# Altium project NRV-AOU34.PrjPCB
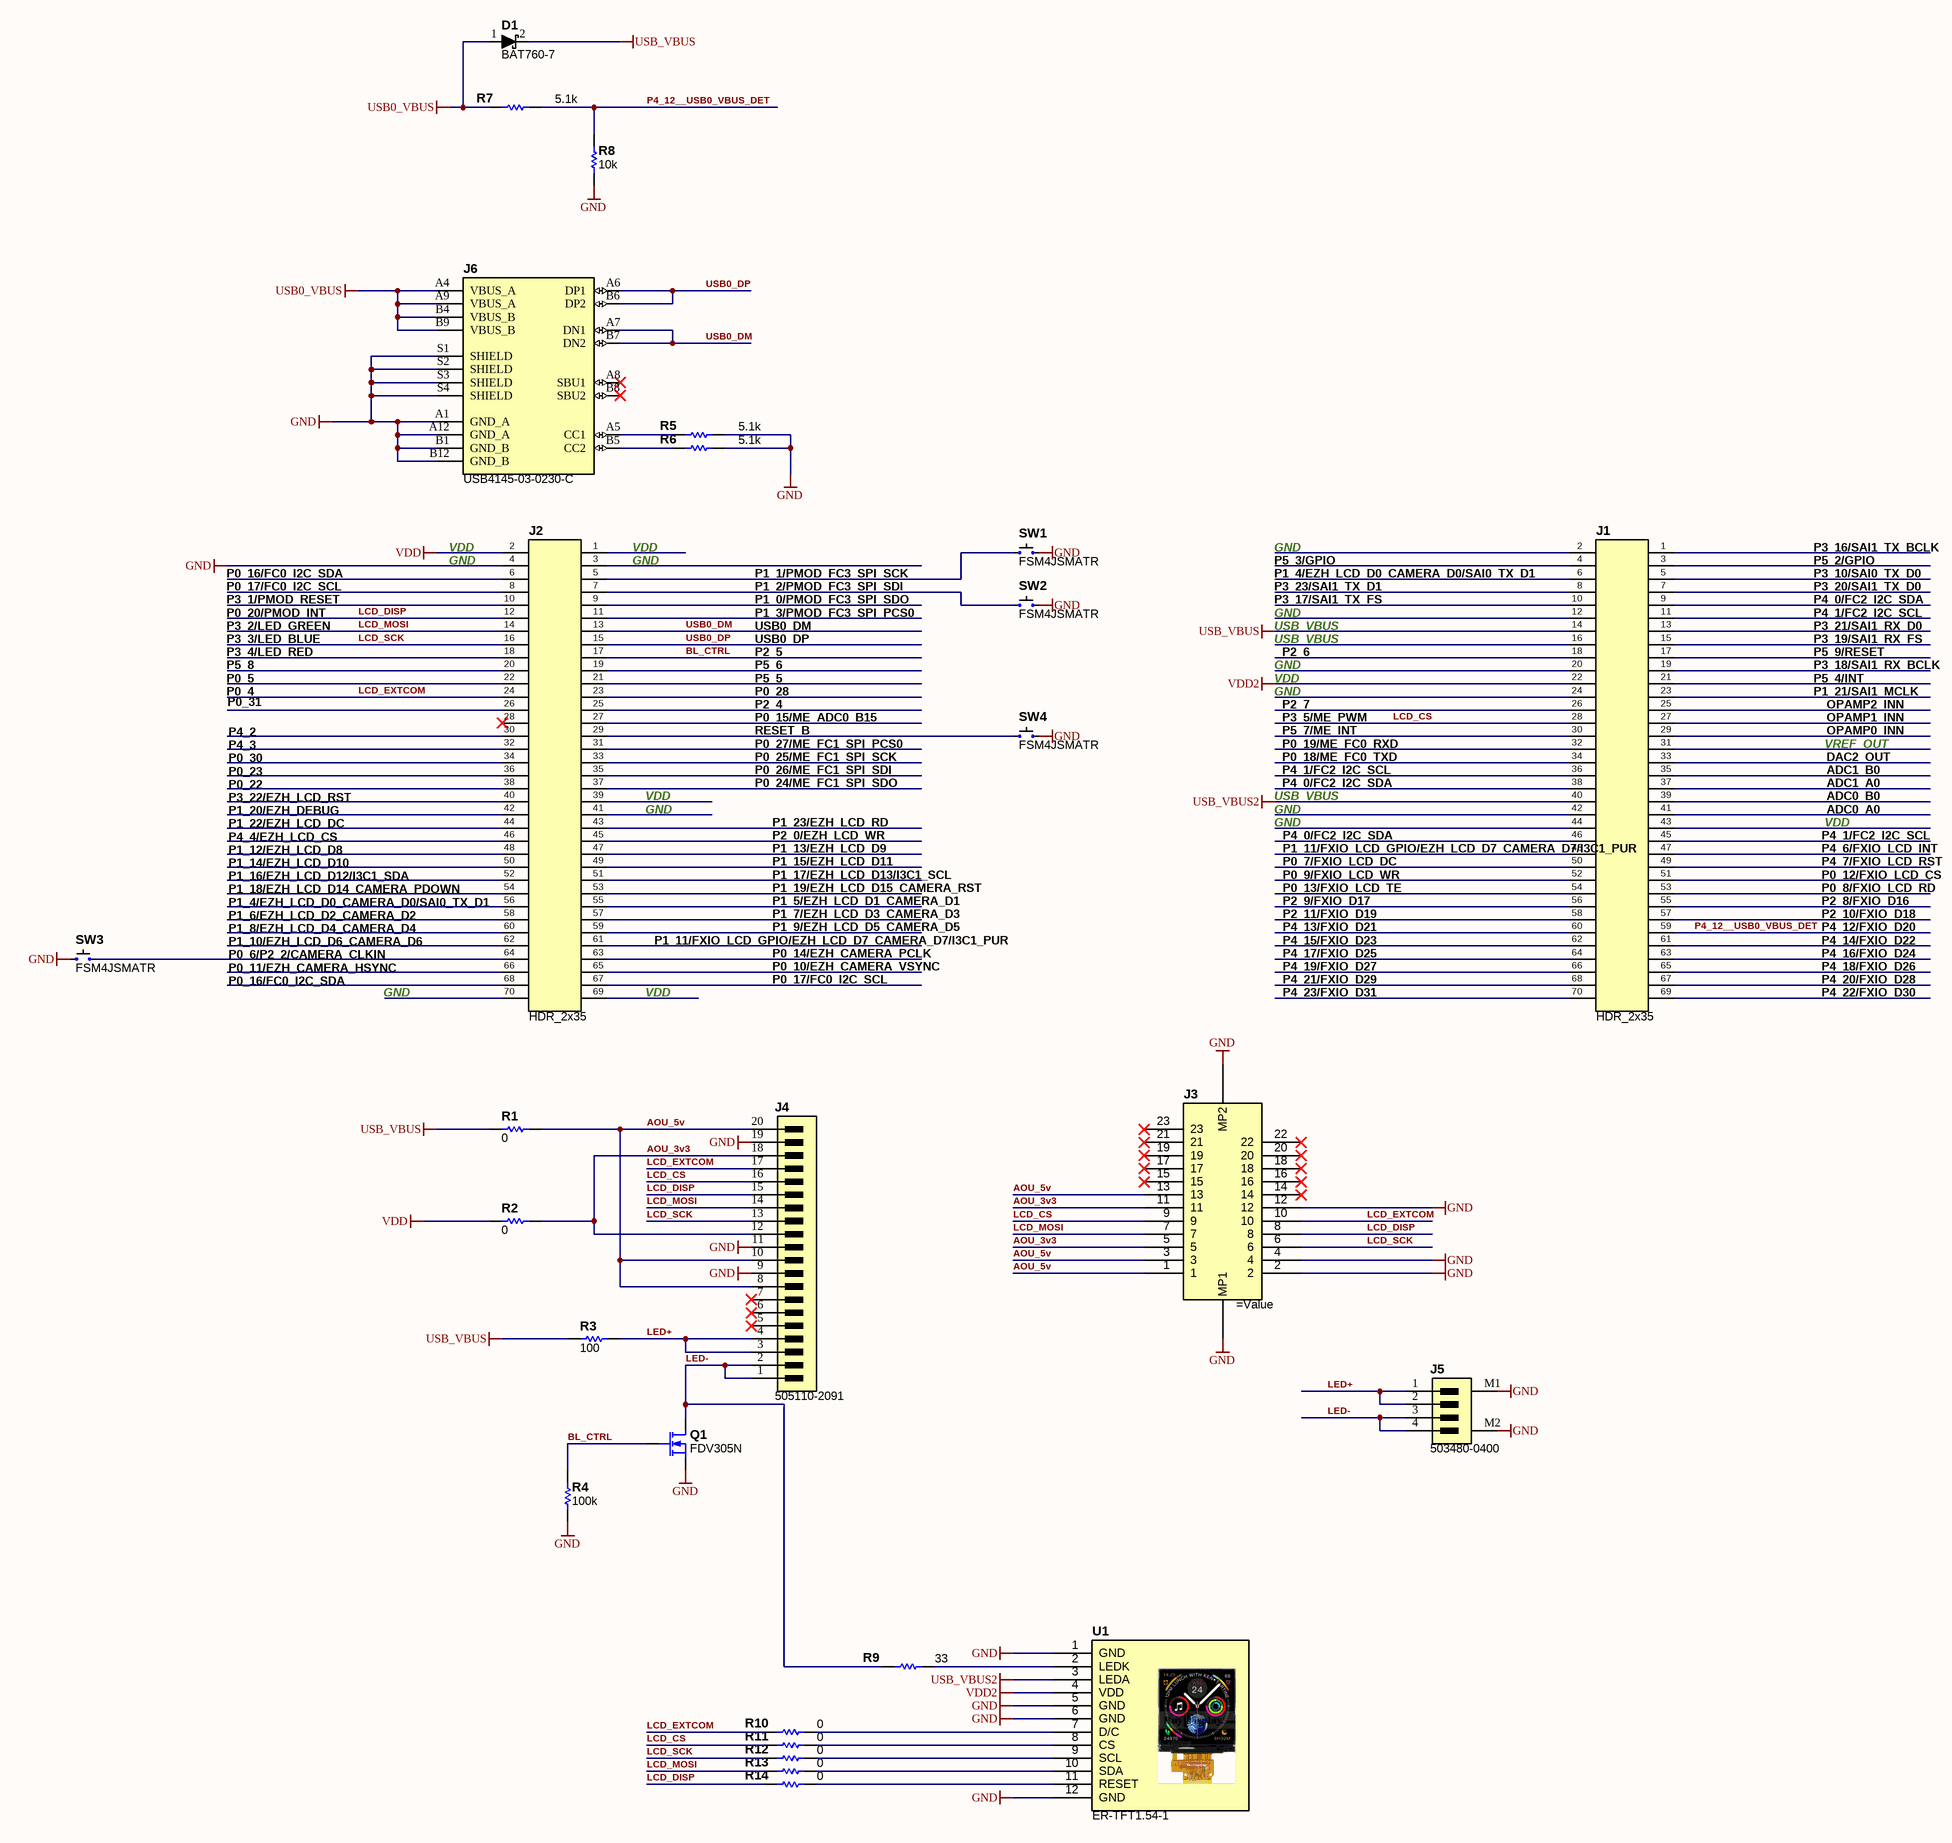
[diagram p0: NRV-AOU34.SchDoc]
SCH_DATE: 2023-04-23; PROJECT_TITLE_LINE_1: NRV_AOU34; PROJECT_STATUS: PROTOTYPE; PROJECT_SHORT_TITLE: NRV_AOU34; PROJECT_ENGINEER: E. Hughes; PCB_VERSION: A; PCB_TITLE: NRV-MEM-LCD; PCB_SOLDER_MASK_COLOR_BOTTOM: BLACK; PCB_SILKSCREEN_COLOR_TOP: BLACK; PCB_SILKSCREEN_COLOR_BOTTOM: none; PCB_PRINTOUT_SCALE: 1:1; PCB_PART_NUMBER: NRV_AOU34; PCB_MIN_TRACE_WIDTH: 6; PCB_MIN_TRACE_SPACE: 6; PCB_MIN_DRILL: 10; PCB_MATERIAL: FR4; PCB_LAYERS: 6; PCB_FINISH_PLATING: GOLD ENIG; PCB_FINISHED_THICKNESS: .0625; PCB_COPPER_WEIGHT_OUTER: 1oz; PCB_COPPER_WEIGHT_INNER: 1oz; CCA_TITLE: Azumo 3.4" Dev; CCA_PART_NUMBER: NRV_AOU34; BOM_NOTES_LINE_4: -; BOM_NOTES_LINE_3: -; BOM_NOTES_LINE_2: -; BOM_NOTES_LINE_1: -
1 sheet, 27 parts. Net scope: hierarchical (ports join the sheet entries above them; power ports are global).
Board file: NRV-AOU34.PCBDOC

## Sheet NRV-AOU34.SchDoc
size D

### Parts
D1  BAT760-7  [D_SOD-323_P]
J1  HDR_2x35  [HEADER 2x35 .100"]
J2  HDR_2x35  [HEADER 2x35 .100"]
J3  (no value)  [FH26W-23S-0.3SHW(60)]
J4  505110-2091  [CON_5051102091_MOL]
J5  503480-0400  [5034800400]
J6  USB4145-03-0230-C  [GCT_USB4145-03-0230-C_REVA2]
Q1  FDV305N  [SOT-23]
R1  0  [R0603_0.55MM_MD]
R2  0  [R0603_0.55MM_MD]
R3  100  [R0805_0.65MM_MD]
R4  100k  [R0805_0.65MM_MD]
R5  5.1k  [R0603_0.55MM_MD]
R6  5.1k  [R0603_0.55MM_MD]
R7  5.1k  [R0603_0.55MM_MD]
R8  10k  [R0603_0.55MM_MD]
R9  33  [R0603_0.55MM_MD]
R10  0  [R0603_0.55MM_MD]
R11  0  [R0603_0.55MM_MD]
R12  0  [R0603_0.55MM_MD]
R13  0  [R0603_0.55MM_MD]
R14  0  [R0603_0.55MM_MD]
SW1  FSM4JSMATR  [FSM4JSMA]
SW2  FSM4JSMATR  [FSM4JSMA]
SW3  FSM4JSMATR  [FSM4JSMA]
SW4  FSM4JSMATR  [FSM4JSMA]
U1  ER-TFT1.54-1  [ER-TFT1.54-1]

### Nets
GND: J2.4 J3.2 J3.4 J3.12 J3.MP1 J3.MP2 J4.9(B4) J4.11(B2) J4.19(G1) J5.M1 J5.M2 J6.A1(GND_A) J6.A12(GND_A) J6.B1(GND_B) J6.B12(GND_B) J6.S1(SHIELD) J6.S2(SHIELD) J6.S3(SHIELD) J6.S4(SHIELD) Q1.2 R4.2 R5.2 R6.2 R8.1 SW1.A SW2.A SW3.A SW4.A U1.1(GND) U1.5(GND) U1.6(GND) U1.12(GND)
USB0_VBUS: D1.1(A) J6.A4(VBUS_A) J6.A9(VBUS_A) J6.B4(VBUS_B) J6.B9(VBUS_B) R7.1
USB_VBUS: D1.2(K) J1.14 R1.1 R3.2
USB_VBUS2: J1.40 U1.3(LEDA)
VDD: J2.2 R2.1
VDD2: J1.22 U1.4(VDD)
AOU_3v3: J3.5 J3.11 J4.12(B1) J4.18(G2) R2.2
AOU_5v: J3.1 J3.3 J3.13 J4.8(B5) J4.10(B3) J4.20(G0) R1.2
BL_CTRL: J2.17 Q1.1(G) R4.1
LCD_CS: J1.28 J3.9 J4.16(G4) R11.1
LCD_DISP: J2.12 J3.8 J4.15(G5) R14.1
LCD_EXTCOM: J2.24 J3.10 J4.17(G3) R10.1
LCD_MOSI: J2.14 J3.7 J4.14(VSS) R13.1
LCD_SCK: J2.16 J3.6 J4.13(B0) R12.1
LED+: J4.3(VCC) J4.4(VCC) J5.1(VSS) J5.2(VSS) R3.1
LED-: J4.1(VSS) J4.2(VSS) J5.3(VCC) J5.4(VCC) Q1.3(D) R9.1
P4_12__USB0_VBUS_DET: J1.59 R7.2 R8.2
USB0_DM: J2.13 J6.A7(DN1) J6.B7(DN2)
USB0_DP: J2.15 J6.A6(DP1) J6.B6(DP2)
NetJ2_5: J2.5 SW1.B
NetJ2_7: J2.7 SW2.B
NetJ2_29: J2.29 SW4.B
NetJ2_64: J2.64 SW3.B
NetJ6_A5: J6.A5(CC1) R5.1
NetJ6_B5: J6.B5(CC2) R6.1
NetR9_2: R9.2 U1.2(LEDK)
NetR10_2: R10.2 U1.7(D/C)
NetR11_2: R11.2 U1.8(CS)
NetR12_2: R12.2 U1.9(SCL)
NetR13_2: R13.2 U1.10(SDA)
NetR14_2: R14.2 U1.11(RESET)

Not connected (* = marked no-connect by the designer): J1 1 2 3 4 5 6 7 8 9 10 11 12 13 15 16 17 18 19 20 21 23 24 25 26 27 29 30 31 32 33 34 35 36 37 38 39 41 42 43 44 45 46 47 48 49 50 51 52 53 54 55 56 57 58 60 61 62 63 64 65 66 67 68 69 70; J2 1 3 6 8 9 10 11 18 19 20 21 22 23 25 26 27 28* 30 31 32 33 34 35 36 37 38 39 40 41 42 43 44 45 46 47 48 49 50 51 52 53 54 55 56 57 58 59 60 61 62 63 65 66 67 68 69 70; J3 14* 15* 16* 17* 18* 19* 20* 21* 22* 23*; J4 5(PWCTRL)* 6(LEDCTRL)* 7(RESET#)*; J6 A8(SBU1)* B8(SBU2)*

### Notes on the sheet
- VDD
- GND
- (near J2) VDD
- (near J2) GND
- P5_3/GPIO
- P3_16/SAI1_TX_BCLK
- P5_2/GPIO
- P0_16/FC0_I2C_SDA
- P0_17/FC0_I2C_SCL
- P3_1/PMOD_RESET
- P0_20/PMOD_INT
- P3_2/LED_GREEN
- P1_1/PMOD_FC3_SPI_SCK
- P1_2/PMOD_FC3_SPI_SDI
- P1_0/PMOD_FC3_SPI_SDO
- P1_3/PMOD_FC3_SPI_PCS0
- USB0_DM
- P1_4/EZH_LCD_D0_CAMERA_D0/SAI0_TX_D1
- P3_23/SAI1_TX_D1
- P3_17/SAI1_TX_FS
- USB_VBUS
- P3_10/SAI0_TX_D0
- P3_20/SAI1_TX_D0
- P4_0/FC2_I2C_SDA
- P4_1/FC2_I2C_SCL
- P3_21/SAI1_RX_D0
- P3_3/LED_BLUE
- P3_4/LED_RED
- P5_8
- P0_5
- P0_4
- USB0_DP
- P2_5
- P5_6
- P5_5
- P0_28
- P2_6
- P3_19/SAI1_RX_FS
- P5_9/RESET
- P3_18/SAI1_RX_BCLK
- P5_4/INT
- P1_21/SAI1_MCLK
- P0_31
- P4_2
- P4_3
- P0_30
- P2_4
- P0_15/ME_ADC0_B15
- RESET_B
- P0_27/ME_FC1_SPI_PCS0
- P0_25/ME_FC1_SPI_SCK
- P2_7
- P3_5/ME_PWM
- P5_7/ME_INT
- P0_19/ME_FC0_RXD
- P0_18/ME_FC0_TXD
- VREF_OUT
- OPAMP2_INN
- OPAMP1_INN
- OPAMP0_INN
- DAC2_OUT
- P0_23
- P0_22
- P3_22/EZH_LCD_RST
- P1_20/EZH_DEBUG
- P1_22/EZH_LCD_DC
- P0_26/ME_FC1_SPI_SDI
- P0_24/ME_FC1_SPI_SDO
- P1_23/EZH_LCD_RD
- ADC1_B0
- ADC1_A0
- ADC0_B0
- ADC0_A0
- P4_4/EZH_LCD_CS
- P1_12/EZH_LCD_D8
- P1_14/EZH_LCD_D10
- P1_16/EZH_LCD_D12/I3C1_SDA
- P1_18/EZH_LCD_D14_CAMERA_PDOWN
- P2_0/EZH_LCD_WR
- P1_13/EZH_LCD_D9
- P1_15/EZH_LCD_D11
- P1_17/EZH_LCD_D13/I3C1_SCL
- P1_19/EZH_LCD_D15_CAMERA_RST
- (near J1) P1_11/FXIO_LCD_GPIO/EZH_LCD_D7_CAMERA_D7/I3C1_PUR
- P0_7/FXIO_LCD_DC
- P0_9/FXIO_LCD_WR
- P0_13/FXIO_LCD_TE
- P4_6/FXIO_LCD_INT
- P4_7/FXIO_LCD_RST
- P0_12/FXIO_LCD_CS
- P0_8/FXIO_LCD_RD
- P1_6/EZH_LCD_D2_CAMERA_D2
- P1_8/EZH_LCD_D4_CAMERA_D4
- P1_10/EZH_LCD_D6_CAMERA_D6
- P0_6/P2_2/CAMERA_CLKIN
- P1_11/FXIO_LCD_GPIO/EZH_LCD_D7_CAMERA_D7/I3C1_PUR
- P1_5/EZH_LCD_D1_CAMERA_D1
- P1_7/EZH_LCD_D3_CAMERA_D3
- P1_9/EZH_LCD_D5_CAMERA_D5
- P0_14/EZH_CAMERA_PCLK
- P2_9/FXIO_D17
- P2_11/FXIO_D19
- P4_13/FXIO_D21
- P4_15/FXIO_D23
- P4_17/FXIO_D25
- P2_8/FXIO_D16
- P2_10/FXIO_D18
- P4_12/FXIO_D20
- P4_14/FXIO_D22
- P4_16/FXIO_D24
- P0_11/EZH_CAMERA_HSYNC
- P0_10/EZH_CAMERA_VSYNC
- P4_19/FXIO_D27
- P4_21/FXIO_D29
- P4_23/FXIO_D31
- P4_18/FXIO_D26
- P4_20/FXIO_D28
- P4_22/FXIO_D30
- PCB REV
- CCA REV
- Sheet
- of

### Library data of the parts
D1 = BAT760-7: DIODE SCHOTTKY 30V 1A SOD323; Manufacturer: Diodes Inc; CategorySort: 400; Voltage - Forward (Vf) (Max) @ If: 550mV @ 1A; Speed: Fast Recovery =< 500ns- > 200mA (Io); Current - Reverse Leakage @ Vr: 50µA @ 15V; Capacitance @ Vr- F: 25pF @ 5V- 1MHz; Num Pins: 2; Diode Suffix: 1A_2C; Category: Diodes; Value: BAT760-7; Manufacturer Part Number: BAT760-7; ComponentLink1Description: Internal Datasheet; ComponentLink1URL: http://www.diodes.com/datasheets/ds30498.pdf; ComponentLink2Description: External Datasheet; ComponentLink2URL: http://www.diodes.com/datasheets/ds30498.pdf; Supplier 1: Digi-Key; Supplier Part Number 1: BAT760DICT-ND; SortValue: BAT760-7; Diode Type: Schottky; Voltage - DC Reverse (Vr) (Max): 30V; Current - Average Rectified (Io): 1A; Reverse Recovery Time (trr): -; Mounting Type: Surface Mount; Package: SC-76- SOD-323; Supplier Device Package: SOD-323; Packaging: Cut Tape (CT)
J1 J2 = HDR_2x35: 2x35 Header .100"; Value: HDR_2x35; Supplier 1: Digi-Key; Supplier Part Number 1: 1849-PR20204VBDN-ND; RoHS: No; Stock: 3387; Pricing: 1=0.16000, 10=0.15400, 100=0.09510, 500=0.07872, 1000=0.06888, 5000=0.05904, 10000=0.05740 (USD)
J3 = FH26W-23S-0.3SHW(60): Manufacturer: Hirose; Manufacturer Part Number: FH26W-23S-0.3SHW(60)
J4 = 505110-2091: Conn, Rect, Rt. Angle, FFC/FPC, 0.50MM Pitch, 20 Circuit, Bottom Contact, ZIF; Manufacturer: Molex; Actuator Material: Nylon,Glass,Polyamide; Actuator Color: Black; Number of Positions: 20; Voltage Rating: 50V; Current Rating: 500mA; Gender: Receptacle; Mating Cycles: 25; Pitch: 0.5mm; Supplier 1: Mouser; Supplier Part Number 1: 538-505110-2091; Manufacturer Part Number: 505110-2091; RoHS: Yes; Category: FFC / FPC; Stock 1: 37659; Pricing: 1=0.95000, 10=0.78000, 50=0.78000, 100=0.65000, 500=0.58500, 1000=0.52000, 3000=0.47100, 6000=0.43200, 9000=0.42200, 10000=0.42200, 24000=0.40600 (USD); Mounting Technology: Surface Mount; Pins: 20; Contact Material: Bronze; Contact Plating: Gold; Housing Material: Polymer; Housing Color: Beige; Min Operating Temperature: -40°C; Max Operating Temperature: 105°C; Packaging: Cut Tape; Termination: Solder; Number of Rows: 1; Number of Circuits: 20; Orientation: Right Angle; Number of Contacts: 20; Series: Easy-On 505110; Height: 1.9mm; Halogen Free: Low Halogen; Flammability Rating: UL94 V-0; Reach SVHC Compliant: Unknown; ComponentLink1URL: http://www.farnell.com/datasheets/2790613.pdf?src-supplier=Farnell; ComponentLink1Description: http://www.farnell.com/datasheets/2790613.pdf?src-supplier=Farnell; ComponentLink2URL: https://media.digikey.com/pdf/Data%20Sheets/Molex%20PDFs/FFC-FPC_Connectors.pdf?src-supplier=Digi-Key; ComponentLink2Description: https://media.digikey.com/pdf/Data%20Sheets/Molex%20PDFs/FFC-FPC_Connectors.pdf?src-supplier=Digi-Key; ComponentLink3URL: http://www.alliedelec.com/images/products/datasheets/bm/MOLEX/70606838.pdf?src-supplier=Allied+Electronics; ComponentLink3Description: http://www.alliedelec.com/images/products/datasheets/bm/MOLEX/70606838.pdf?src-supplier=Allied+Electronics; ComponentLink4URL: http://www.molex.com/pdm_docs/sd/5051102091_sd.pdf?src-supplier=Avnet; ComponentLink4Description: http://www.molex.com/pdm_docs/sd/5051102091_sd.pdf?src-supplier=Avnet; ComponentLink5URL: http://www.farnell.com/datasheets/2790613.pdf?src-supplier=Element14; ComponentLink5Description: http://www.farnell.com/datasheets/2790613.pdf?src-supplier=Element14; ComponentLink6URL: http://www.farnell.com/datasheets/2790613.pdf?src-supplier=Newark; ComponentLink6Description: http://www.farnell.com/datasheets/2790613.pdf?src-supplier=Newark; Value: 505110-2091
J5 = 503480-0400: CONN FFC FPC 4POS 0.50MM R/A; Manufacturer: Molex; Actuator Material: Nylon,Glass,Polyamide; Number of Contacts: 4; Current Rating: 500mA; Voltage Rating: 50V; Gender: Female; Wire/Cable Type: Straight; Stackable: No; Mating Cycles: 10; Pitch: 0.5mm; Value: 503480-0400; Supplier 1: Digi-Key; Supplier Part Number 1: WM1386CT-ND; Manufacturer Part Number: 503480-0400; Stock: 3204; Pricing: 1=0.7, 10=0.652, 25=0.5864, 50=0.5214, 100=0.4997, 250=0.4562, 500=0.4345, 1000=0.3585 (USD); RoHS: Yes; Contact Material: Bronze; Contact Plating: Gold; Housing Color: White; Material: Bronze; Housing Material: Polymer; Min Operating Temperature: -40°C; Max Operating Temperature: 85°C; Number of Rows: 1; Termination: Solder; Orientation: Right Angle; Package Quantity: 1; Voltage Rating (AC): 50V; Packaging: Tape and Reel; Number of Positions: 4; Max Voltage Rating (AC): 50V; Max Voltage Rating (DC): 50V; Number of Circuits: 4; Length: 3.7mm; Depth: 4mm; Radiation Hardening: No; REACH SVHC: No SVHC; Halogen Free: Low Halogen; ELV: Compliant; Flammability Rating: UL94 V-0; ComponentLink1URL: https://datasheet.ciiva.com/671/5034800400-sd-671136.pdf?src-supplier=Digi-Key; ComponentLink1Description: https://datasheet.ciiva.com/671/5034800400-sd-671136.pdf?src-supplier=Digi-Key; ComponentLink2URL: https://datasheet.ciiva.com/15249/392825034800400-ffc-fpc-nectors-15249120.pdf?src-supplier=Arrow+Europe; ComponentLink2Description: https://datasheet.ciiva.com/15249/392825034800400-ffc-fpc-nectors-15249120.pdf?src-supplier=Arrow+Europe; ComponentLink3URL: https://datasheet.ciiva.com/16658/5034800400-ffc-fpc-connectors-16658883.pdf?src-supplier=Avnet+Europe; ComponentLink3Description: https://datasheet.ciiva.com/16658/5034800400-ffc-fpc-connectors-16658883.pdf?src-supplier=Avnet+Europe; ComponentLink4URL: https://datasheet.ciiva.com/3926/135095034800400-ffc-fpc-nectors-3926214.pdf?src-supplier=Arrow; ComponentLink4Description: https://datasheet.ciiva.com/3926/135095034800400-ffc-fpc-nectors-3926214.pdf?src-supplier=Arrow; ComponentLink5URL: https://datasheet.ciiva.com/5137/5034800400-ffc-fpc-connectors-179546-5137607.pdf?src-supplier=Mouser; ComponentLink5Description: https://datasheet.ciiva.com/5137/5034800400-ffc-fpc-connectors-179546-5137607.pdf?src-supplier=Mouser; ComponentLink6URL: https://datasheet.ciiva.com/671/5034800400-sd-671137.pdf?src-supplier=Digi-Key; ComponentLink6Description: https://datasheet.ciiva.com/671/5034800400-sd-671137.pdf?src-supplier=Digi-Key; ComponentLink7URL: https://datasheet.ciiva.com/10366/5034800400-ffc-fpc-connectors-10366566.pdf?src-supplier=Avnet; ComponentLink7Description: https://datasheet.ciiva.com/10366/5034800400-ffc-fpc-connectors-10366566.pdf?src-supplier=Avnet; ComponentLink8URL: https://datasheet.ciiva.com/671/5034800400-sd-671138.pdf?src-supplier=Digi-Key; ComponentLink8Description: https://datasheet.ciiva.com/671/5034800400-sd-671138.pdf?src-supplier=Digi-Key
J6 = USB4145-03-0230-C: USB Connectors USB-C Rec 3u" Vert 16P SMT 2.3mm TH stakes H7.46mm T+R+Cap; Manufacturer: GCT; Price: None; Value: USB4145-03-0230-C; Package: None; Availability: Unavailable; Manufacturer Part Number: USB4145-03-0230-C
Q1 = FDV305: MOSFET N-CH 20V 0.9A SOT-23; Source Part Number: FDV305NCT-ND; Manufacturer: Fairchild Semiconductor; Source: Digikey; Manufacturer Part Number: FDV305N; ROHS Certificate: *; Value: FDV305N
R1 R2 R10-R14 = R: Value: 1k; ComponentLink1URL: http://industrial.panasonic.com/www-cgi/jvcr13pz.cgi?E+PZ+3+AOA0002+ERJ3EKF10R0V+7+WW; ComponentLink1Description: http://industrial.panasonic.com/www-cgi/jvcr13pz.cgi?E+PZ+3+AOA0002+ERJ3EKF10R0V+7+WW
R3 R4 = R: 0; Value: 1k; ComponentLink1URL: http://industrial.panasonic.com/www-cgi/jvcr13pz.cgi?E+PZ+3+AOA0002+ERJ3EKF10R0V+7+WW; ComponentLink1Description: http://industrial.panasonic.com/www-cgi/jvcr13pz.cgi?E+PZ+3+AOA0002+ERJ3EKF10R0V+7+WW
R5-R9 = R: 0; ComponentLink1URL: http://industrial.panasonic.com/www-cgi/jvcr13pz.cgi?E+PZ+3+AOA0002+ERJ3EKF10R0V+7+WW; ComponentLink1Description: http://industrial.panasonic.com/www-cgi/jvcr13pz.cgi?E+PZ+3+AOA0002+ERJ3EKF10R0V+7+WW
  R5-R7: Value: 5.1k
  R8: Value: 10k
  R9: Value: 33
SW1-SW4 = FSM4JSMATR: SWITCH TACTILE SPST-NO 0.05A 12V; Manufacturer: TE Connectivity; Switch Function: Off-Mom; Contact Rating @ Voltage: 0.05A @ 12VDC; Actuator Type: Standard; Actuator Orientation: Top Actuated; Outline: 6.00mm x 6.00mm; Illumination: Non-Illuminated; Operating Force: 160gf; Supplier 1: Digi-Key; Supplier Part Number 1: 450-1759-1-ND; Manufacturer Part Number: FSM4JSMATR; RoHS: RoHS Compliant; Category: Switches; Stock 1: 35617; Pricing 1: 1=0.36, 10=0.34, 25=0.2912, 50=0.2474, 100=0.2377, 250=0.21344, 500=0.20374 (USD); Circuit: SPST-NO; Mounting Type: Surface Mount; Termination Style: Gull Wing; Packaging: Cut Tape (CT); ComponentLink1URL: http://documents.tycoelectronics.com/commerce/DocumentDelivery/DDEController?Action=srchrtrv&DocNm=2-1437565-7&DocType=CD&DocLang=EN; ComponentLink1Description: http://documents.tycoelectronics.com/commerce/DocumentDelivery/DDEController?Action=srchrtrv&DocNm=2-1437565-7&DocType=CD&DocLang=EN; Value: FSM4JSMATR
U1 = ER-TFT1.54-1: 1.54" 240x240 IPS Display; Manufacturer: Buy Display; Value: ER-TFT1.54-1; Manufacturer Part Number: ER-TFT1.54-1

## Assembly variants
A: all parts fitted